# EAGLE design Testing Sockets (EAGLE 6.3)
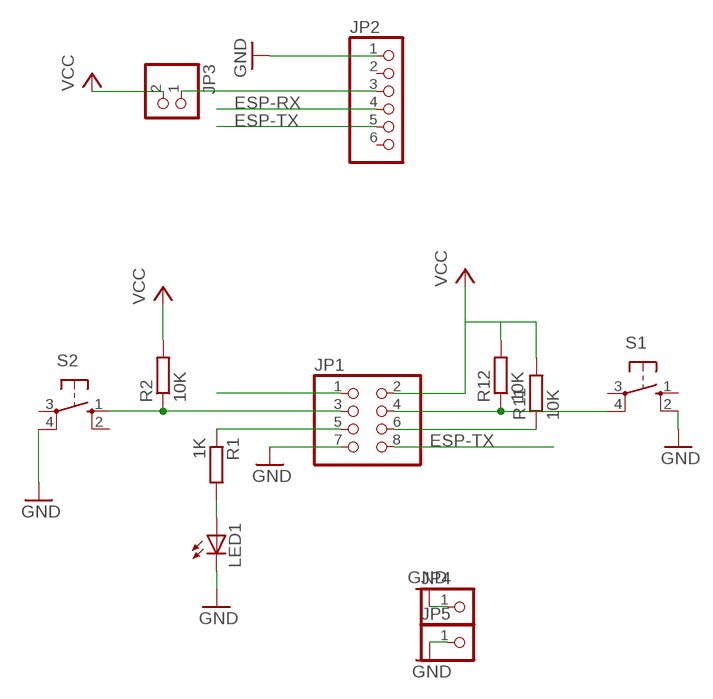
[diagram p0: schematic, sheet 1]

## Parts
JP1  PINHD-2X4  [2X04]
JP2  PINHD-1X6  [1X06]
JP3  PINHD-1X2  [1X02]
JP4  PINHD-1X1  [1X01]
JP5  PINHD-1X1  [1X01]
LED1  LED5MM  [LED5MM]
R1  1K  R-EU_0207/10  [0207/10]
R2  10K  R-EU_0207/10  [0207/10]
R11  10K  R-EU_0207/10  [0207/10]
R12  10K  R-EU_0207/10  [0207/10]
S1  10-XX  [B3F-10XX]
S2  10-XX  [B3F-10XX]

## Nets
ESP-RX: JP1.1 JP2.4
ESP-TX: JP1.8 JP2.5
GND: JP1.7 JP2.1 JP4.1 JP5.1 LED1.K(C) S1.2(S1) S2.4(P1)
N$1: JP1.5 R1.1
N$2: LED1.A R1.2
N$3: JP2.3 JP3.1
N$11: JP1.6 R11.1
N$13: JP1.4 R12.1 S1.4(P1)
SOCKET1: JP1.3 R2.1 S2.1(S)
VCC: JP1.2 JP3.2 R2.2 R11.2 R12.2
Unconnected: JP2.2 JP2.6 S1.1(S) S1.3(P) S2.2(S1) S2.3(P)

## Library data of the parts
JP1 = pinhead:PINHD-2X4: PIN HEADER
JP2 = pinhead:PINHD-1X6: PIN HEADER
JP3 = pinhead:PINHD-1X2: PIN HEADER
JP4 JP5 = pinhead:PINHD-1X1: PIN HEADER
LED1 = led:LED: LED OSRAM: - CHIPLED LG R971, LG N971, LY N971, LG Q971, LY Q971, LO R971, LY R971 LH N974, LH R974 LS Q976, LO Q976, LY Q976 LO Q996 - Hyper CHIPLED LW Q18S LB Q993, LB Q99A, LB R99A - SideLED LS A670, LO A670, LY A670, LG A670, LP A670 LB A673, LV A673, LT A673, LW A673 LH A674 LY A675 LS A676, LA A676, LO A676, LY A676, LW A676 LS A679, LY A679, LG A679 - Hyper Micro SIDELED® LS Y876, LA Y876, LO Y876, LY Y876 LT Y87S - SmartLED LW L88C, LW L88S LB L89C, LB L89S, LG L890 LS L89K, LO L89K, LY L89K LS L896, LA L896, LO L896, LY L896 - TOPLED LS T670, LO T670, LY T670, LG T670, LP T670 LSG T670, LSP T670, LSY T670, LOP T670, LYG T670 LG T671, LOG T671, LSG T671 LB T673, LV T673, LT T673, LW T673 LH T674 LS T676, LA T676, LO T676, LY T676, LB T676, LH T676, LSB T676, LW T676 LB T67C, LV T67C, LT T67C, LS T67K, LO T67K, LY T67K, LW E67C LS E67B, LA E67B, LO E67B, LY E67B, LB E67C, LV E67C, LT E67C LW T67C LS T679, LY T679, LG T679 LS T770, LO T770, LY T770, LG T770, LP T770 LB T773, LV T773, LT T773, LW T773 LH T774 LS E675, LA E675, LY E675, LS T675 LS T776, LA T776, LO T776, LY T776, LB T776 LHGB T686 LT T68C, LB T68C - Hyper Mini TOPLED® LB M676 - Mini TOPLED Santana® LG M470 LS M47K, LO M47K, LY M47K Source: http://www.osram.convergy.de LUXEON: - LUMILED® LXK2-PW12-R00, LXK2-PW12-S00, LXK2-PW14-U00, LXK2-PW14-V00 LXK2-PM12-R00, LXK2-PM12-S00, LXK2-PM14-U00 LXK2-PE12-Q00, LXK2-PE12-R00, LXK2-PE12-S00, LXK2-PE14-T00, LXK2-PE14-U00 LXK2-PB12-K00, LXK2-PB12-L00, LXK2-PB12-M00, LXK2-PB14-N00, LXK2-PB14-P00, LXK2-PB14-Q00 LXK2-PR12-L00, LXK2-PR12-M00, LXK2-PR14-Q00, LXK2-PR14-R00 LXK2-PD12-Q00, LXK2-PD12-R00, LXK2-PD12-S00 LXK2-PH12-R00, LXK2-PH12-S00 LXK2-PL12-P00, LXK2-PL12-Q00, LXK2-PL12-R00 Source: www.luxeon.com KINGBRIGHT: KA-3528ASYC Source: www.kingbright.com
R1 R2 R11 R12 = rcl:R-EU_: RESISTOR, European symbol
S1 S2 = switch-omron:10-XX: OMRON SWITCH; MPN: B3F-1000; OC_FARNELL: 176432; OC_NEWARK: 36M3542

## Board
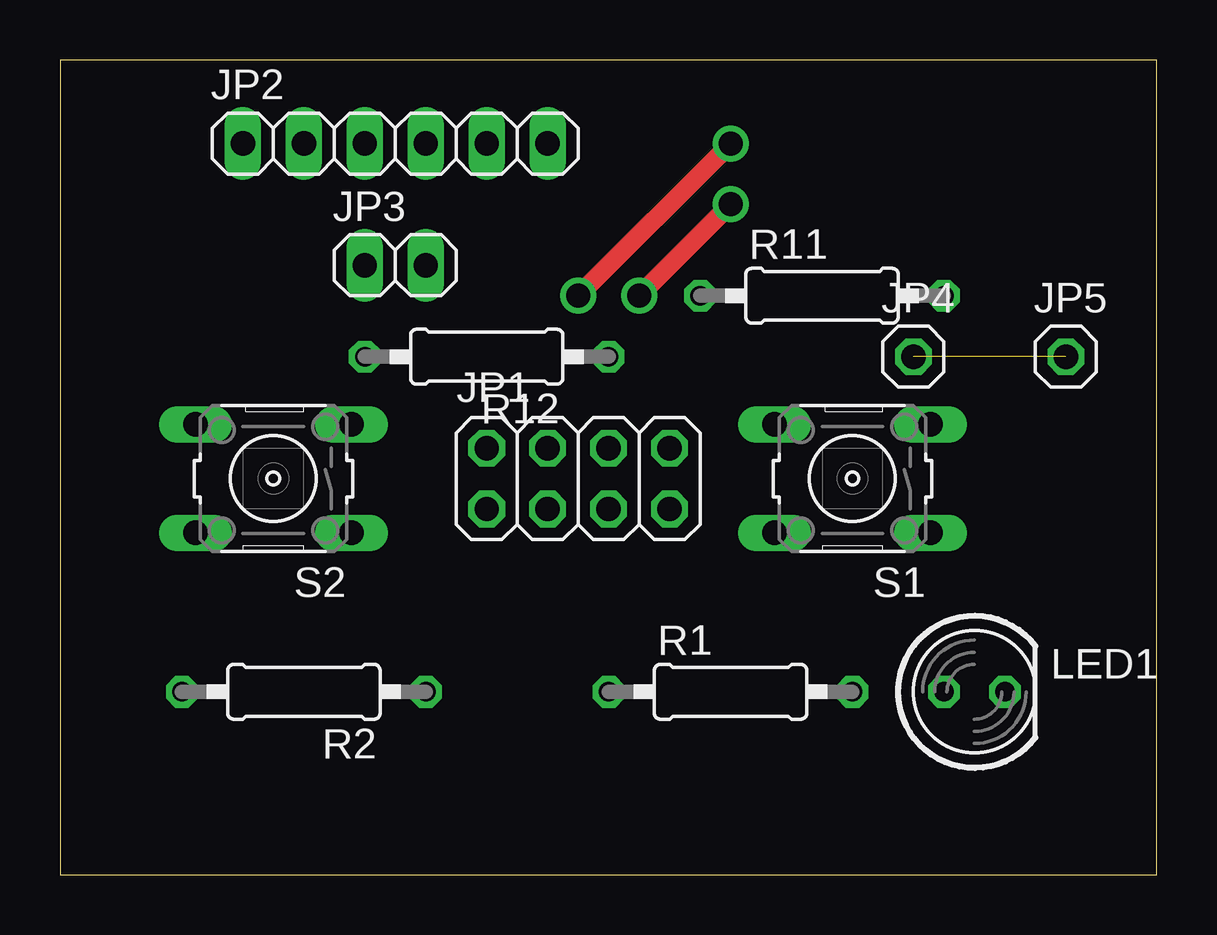
[diagram p1: board, top side]
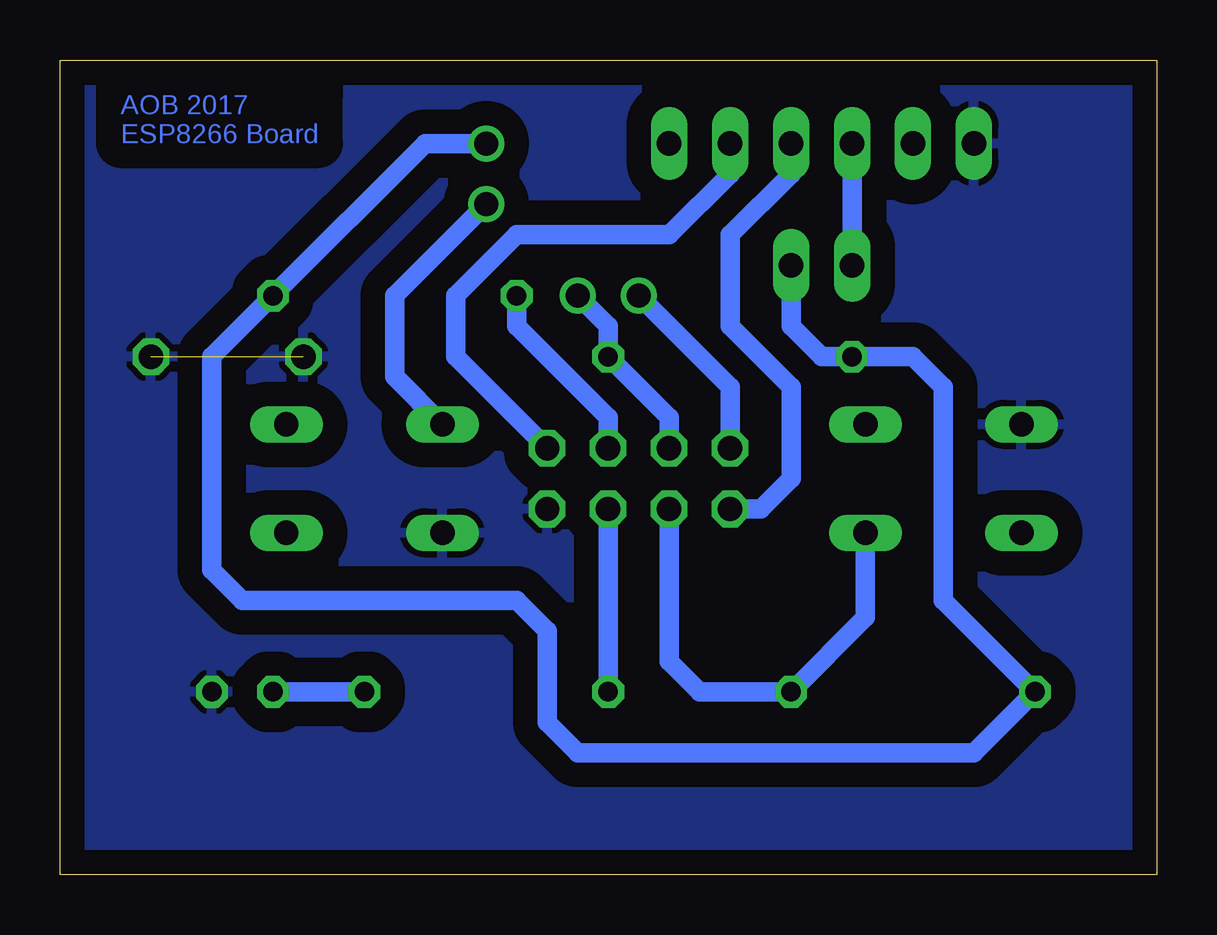
[diagram p2: board, bottom side, seen from below]

Size 45.7 x 33.96 mm. Coordinates in mm from the lower left corner, seen from the top.
Outline: 0,0 45.7,0 45.7,33.96 0,33.96 0,0
Copper layers (1*16): Top 0.035mm / dielectric 1.5mm / Bottom 0.035mm
Design rules "default": minimum track width 10mil, minimum drill 24mil, track to track 8mil, track to pad 8mil, pad to pad 8mil, via to via 8mil, smd to smd 8mil, copper to edge 40mil, drill to drill 8mil, minimum pad ring 10mil, minimum via ring 8mil, stop-mask expansion 4mil, vias tented up to drill 0mil, thermal gap 10mil

### Footprints (pad centres in the part's own frame; a part is rotated, then mirrored left to right if it is on the bottom)
2X04 = drill 1.016 octagon: 1 -3.81,-1.27; 2 -3.81,1.27; 3 -1.27,-1.27; 4 -1.27,1.27; 5 1.27,-1.27; 6 1.27,1.27; 7 3.81,-1.27; 8 3.81,1.27
1X06 = drill 1.016 long: 1 -6.35,0; 2 -3.81,0; 3 -1.27,0; 4 1.27,0; 5 3.81,0; 6 6.35,0
1X02 = drill 1.016 long: 1 -1.27,0; 2 1.27,0
1X01 = drill 1.016 octagon: 1 0,0
LED5MM = drill 0.813 octagon: A -1.27,0; K 1.27,0
0207/10 = drill 0.813 octagon: 1 -5.08,0; 2 5.08,0
B3F-10XX = drill 1.016 long: 1 -3.251,2.261; 2 3.251,2.261; 3 -3.251,-2.261; 4 3.251,-2.261

### Placement (x,y rotation side)
JP1  21.59,16.51 0 top
JP2  13.97,30.48 0 top
JP3  13.97,25.4 0 top
JP4  35.56,21.59 0 top
JP5  41.91,21.59 0 top
LED1  38.1,7.62 0 top
R1  27.94,7.62 0 top
R2  10.16,7.62 180 top
R11  31.75,24.13 0 top
R12  17.78,21.59 180 top
S1  33.02,16.51 180 top
S2  8.89,16.51 180 top

### Tracks (layer width: path | path; a pad name or v marks a point on that pad's centre or on a via)
ESP-RX
  Bottom 0.813: JP2.4 15.24,29.21 17.78,26.67 17.78,22.86 15.24,20.32 15.24,16.51 16.51,15.24 JP1.1
ESP-TX
  Bottom 0.813: JP2.5 17.78,29.21 20.32,26.67 26.67,26.67 29.21,24.13 29.21,21.59 JP1.8
GND  (1 unrouted)
  pour Bottom (isolate 1.016): 0,0 45.72,0 45.72,34.29 0,34.29
N$1
  Bottom 0.813: JP1.5 R1.1
N$2
  Bottom 0.813: LED1.A R1.2
N$3
  Bottom 0.813: JP2.3 JP3.1
N$11
  Bottom 0.813: R11.1 26.67,22.86 22.86,19.05 JP1.6
N$13  (via drill 1)
  Top 0.813: v24.13,24.13 v27.94,27.94
  Bottom 0.813: JP1.4 20.32,19.05 R12.1 22.86,22.86 v24.13,24.13 | v27.94,27.94 31.75,24.13 31.75,20.75 S1.4
SOCKET1
  Bottom 0.813: JP1.3 20.32,8.89 19.05,7.62 R2.1 12.14,10.72 S2.1
VCC  (via drill 1)
  Top 0.813: v21.59,24.13 v27.94,30.48
  Bottom 0.813: JP3.2 15.24,22.86 13.97,21.59 R12.2 10.16,21.59 8.89,20.32 8.89,11.43 R2.2 7.62,5.08 24.13,5.08 25.4,6.35 25.4,10.16 26.67,11.43 38.1,11.43 39.37,12.7 39.37,21.59 R11.2 30.48,30.48 v27.94,30.48 | JP1.2 17.78,20.32 v21.59,24.13

### Text on the board
Bottom: AOB 2017 / ESP8266 Board